# Altium schematic sheet MK2.SchDoc
size A4
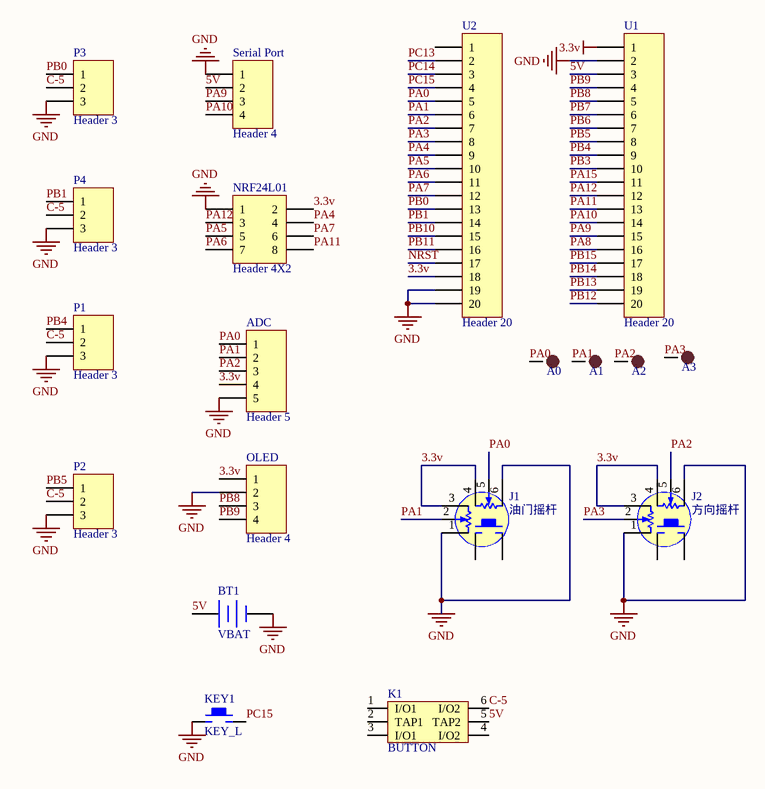
[diagram p0: MK2.SchDoc]

## Parts
A0  TEST POINT  [TP-1.5]  (value not drawn)
A1  TEST POINT  [TP-1.5]  (value not drawn)
A2  TEST POINT  [TP-1.5]  (value not drawn)
A3  TEST POINT  [TP-1.5]  (value not drawn)
ADC  Header 5  [HDR1X5]
BT1  VBAT  [BAT-2]
J1  油门摇杆  [摇杆2]
J2  方向摇杆  [摇杆2]
K1  BUTTON  [BTN8.5*8.5]
KEY1  KEY_L  [KEY_M]
NRF24L01  Header 4X2  [HDR2X4]
OLED  Header 4  [HDR1X4]
P1  Header 3  [HDR1X3]
P2  Header 3  [HDR1X3]
P3  Header 3  [HDR1X3]
P4  Header 3  [HDR1X3]
Serial_Port  Header 4  [HDR1X4]
U1  Header 20  [HDR1X20]
U2  Header 20  [HDR1X20]

## Nets
3.3v: ADC.4 J1.3 J1.4 J2.3 J2.4 NRF24L01.2 OLED.1 U1.1 U2.18
GND: ADC.5 BT1.2(-) J1.1 J1.6 J2.1 J2.6 KEY1.1 NRF24L01.1 OLED.2 P1.3 P2.3 P3.3 P4.3 Serial_Port.1 U1.2 U2.19 U2.20
5V: BT1.1(+) K1.5(TAP2) Serial_Port.2 U1.3
C-5: K1.6(I/O2) P1.2 P2.2 P3.2 P4.2
NRST: U2.17
PA0: A0.1 ADC.1 J1.5 U2.5
PA1: A1.1 ADC.2 J1.2 U2.6
PA2: A2.1 ADC.3 J2.5 U2.7
PA3: A3.1 J2.2 U2.8
PA4: NRF24L01.4 U2.9
PA5: NRF24L01.5 U2.10
PA6: NRF24L01.7 U2.11
PA7: NRF24L01.6 U2.12
PA8: U1.16
PA9: Serial_Port.3 U1.15
PA10: Serial_Port.4 U1.14
PA11: NRF24L01.8 U1.13
PA12: NRF24L01.3 U1.12
PA15: U1.11
PB0: P3.1 U2.13
PB1: P4.1 U2.14
PB3: U1.10
PB4: P1.1 U1.9
PB5: P2.1 U1.8
PB6: U1.7
PB7: U1.6
PB8: OLED.3 U1.5
PB9: OLED.4 U1.4
PB10: U2.15
PB11: U2.16
PB12: U1.20
PB13: U1.19
PB14: U1.18
PB15: U1.17
PC13: U2.2
PC14: U2.3
PC15: KEY1.2 U2.4

Not connected (* = marked no-connect by the designer): J1 J1 J2; J2 J1 J2; K1 1(I/O1) 2(TAP1) 3(I/O1) 4(I/O2); U2 1

## Library data of the parts
A0-A3 = TEST-POINT: 测试点
ADC = Header 5: Header, 5-Pin; LatestRevisionDate: 17-Jul-2002; LatestRevisionNote: Re-released for DXP Platform.; Publisher: Altium Limited
BT1 = Battery: Multicell Battery; Published: 24-Mar-1999; LatestRevisionDate: 17-Jul-2002; LatestRevisionNote: Re-released for DXP Platform.; PackageReference: BAT-2; Publisher: Altium Limited
J1 = 摇杆
J2 = 摇杆_1: 摇杆
KEY1 = KEY
NRF24L01 = Header 4X2: Header, 4-Pin, Dual row; LatestRevisionDate: 17-Jul-2002; LatestRevisionNote: Re-released for DXP Platform.; Publisher: Altium Limited
OLED Serial_Port = Header 4: Header, 4-Pin; LatestRevisionDate: 17-Jul-2002; LatestRevisionNote: Re-released for DXP Platform.; Publisher: Altium Limited
P1-P4 = Header 3: Header, 3-Pin; LatestRevisionDate: 17-Jul-2002; LatestRevisionNote: Re-released for DXP Platform.; Publisher: Altium Limited
U1 U2 = Header 20: Header, 20-Pin; LatestRevisionDate: 17-Jul-2002; LatestRevisionNote: Re-released for DXP Platform.; Publisher: Altium Limited